# Altium schematic sheet MCU.SchDoc
size 420 x 297 mm; SheetNumber: 3; SheetTotal: 16
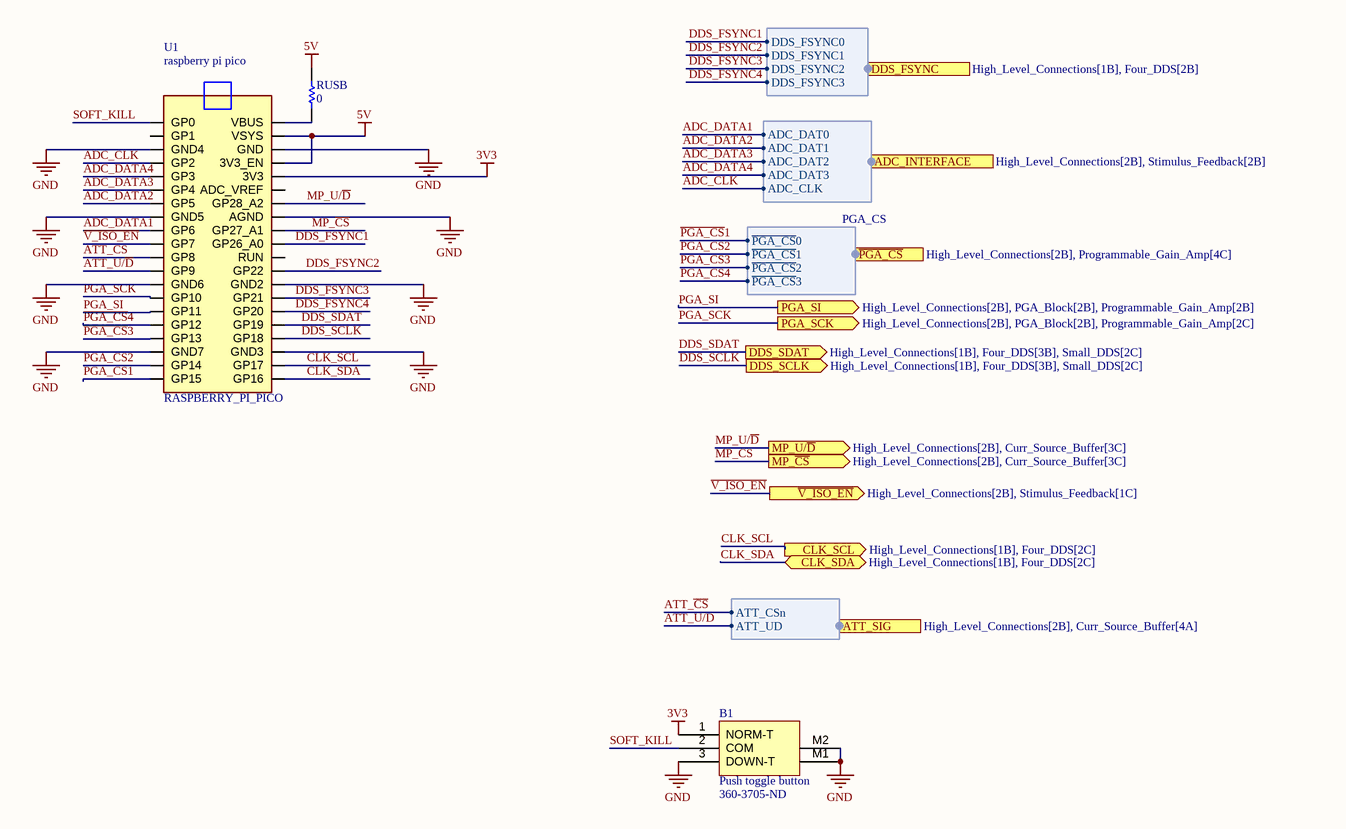
[diagram p0: MCU.SchDoc]

## Parts
B1  Push toggle button  Supplier Part Number 1: 360-3705-ND  [BB16AH-FA]
RUSB  value 0  [0402_Res]  (hidden comment: DNP)
U1  RASPBERRY_PI_PICO  [RASPBERRY_PI_PICO]

## Ports
ADC_INTERFACE (harness ADC_DATA, see High_Level_Connections[2B], Stimulus_Feedback[2B]), ATT_SIG (harness ATT, see High_Level_Connections[2B], Curr_Source_Buffer[4A]), CLK_SCL (out, see High_Level_Connections[1B], Four_DDS[2C]), CLK_SDA (bidir, see High_Level_Connections[1B], Four_DDS[2C]), DDS_FSYNC (harness DDS_FSYNC, see High_Level_Connections[1B], Four_DDS[2B]), DDS_SCLK (out, see High_Level_Connections[1B], Four_DDS[3B], Small_DDS[2C]), DDS_SDAT (out, see High_Level_Connections[1B], Four_DDS[3B], Small_DDS[2C]), MP_U/~{D} (out, see High_Level_Connections[2B], Curr_Source_Buffer[3C]), MP_~{CS} (out, see High_Level_Connections[2B], Curr_Source_Buffer[3C]), PGA_SCK (out, see High_Level_Connections[2B], PGA_Block[2B], Programmable_Gain_Amp[2C]), PGA_SI (out, see High_Level_Connections[2B], PGA_Block[2B], Programmable_Gain_Amp[2B]), ~{PGA_CS} (in, harness PGA_CS, see High_Level_Connections[2B], Programmable_Gain_Amp[4C]), ~{V_ISO_EN} (out, see High_Level_Connections[2B], Stimulus_Feedback[1C])

## Harnesses
ADC_DATA: ADC_DAT0, ADC_DAT1, ADC_DAT2, ADC_DAT3, ADC_CLK
PGA_CS: ~{PGA_CS}0, ~{PGA_CS}1, ~{PGA_CS}2, ~{PGA_CS}3
DDS_FSYNC: DDS_FSYNC0, DDS_FSYNC1, DDS_FSYNC2, DDS_FSYNC3
ATT: ATT_CSn, ATT_UD

## Nets
3V3: B1.1(NORM-T) U1.3V3
5V: RUSB.1 U1.3V3_EN U1.VSYS
GND: B1.3(DOWN-T) B1.M1 B1.M2 U1.AGND U1.GND U1.GND2 U1.GND3 U1.GND4 U1.GND5 U1.GND6 U1.GND7
~{PGA_CS}1: U1.GP15 ; port ~{PGA_CS}.~{PGA_CS}0
~{PGA_CS}2: U1.GP14 ; port ~{PGA_CS}.~{PGA_CS}1
~{PGA_CS}3: U1.GP13 ; port ~{PGA_CS}.~{PGA_CS}2
~{PGA_CS}4: U1.GP12 ; port ~{PGA_CS}.~{PGA_CS}3
~{V_ISO_EN}: U1.GP7 ; port ~{V_ISO_EN}
ADC_CLK: U1.GP2 ; port ADC_INTERFACE.ADC_CLK
ADC_DATA1: U1.GP6 ; port ADC_INTERFACE.ADC_DAT0
ADC_DATA2: U1.GP5 ; port ADC_INTERFACE.ADC_DAT1
ADC_DATA3: U1.GP4 ; port ADC_INTERFACE.ADC_DAT2
ADC_DATA4: U1.GP3 ; port ADC_INTERFACE.ADC_DAT3
ATT_~{CS}: U1.GP8 ; port ATT_SIG.ATT_CSn
ATT_U/~{D}: U1.GP9 ; port ATT_SIG.ATT_UD
CLK_SCL: U1.GP17 ; port CLK_SCL
CLK_SDA: U1.GP16 ; port CLK_SDA
DDS_FSYNC1: U1.GP26_A0 ; port DDS_FSYNC.DDS_FSYNC0
DDS_FSYNC2: U1.GP22 ; port DDS_FSYNC.DDS_FSYNC1
DDS_FSYNC3: U1.GP21 ; port DDS_FSYNC.DDS_FSYNC2
DDS_FSYNC4: U1.GP20 ; port DDS_FSYNC.DDS_FSYNC3
DDS_SCLK: U1.GP18 ; port DDS_SCLK
DDS_SDAT: U1.GP19 ; port DDS_SDAT
MP_~{CS}: U1.GP27_A1 ; port MP_~{CS}
MP_U/~{D}: U1.GP28_A2 ; port MP_U/~{D}
PGA_SCK: U1.GP10 ; port PGA_SCK
PGA_SI: U1.GP11 ; port PGA_SI
SOFT_KILL: B1.2(COM) U1.GP0
NetRUSB_2: RUSB.2 U1.VBUS

Not connected (* = marked no-connect by the designer): U1 ADC_VREF GP1 RUN

## Notes on the sheet
- THIS DOCUMENT AND THE DATA DISCLOSED HEREIN OR
- HEREWITH IS THE PROPERTY OF ALTIUM LIMITED AND MAY
- DWG NO:
- REVISION
- REV:
- DESCRIPTION
- DATE
- APPROVED
- BE FREELY DISTRIBUTED IN WHOLE. NO RIGHTS ARE
- RESERVED OR EXPRESS OR IMPLIED WARANTEE GIVEN.
- ENG:
- APPROVALS
- PROJECT
- DSN:
- CHK:
- REFERENCE DOCUMENTS
- PROJECT REVISION:
- TITLE
- DOCUMENT REVISION:
- DESIGN ITEM:
- BOM:
- FAB DWG:
- PCB DWG:
- ASSY DWG:
- SCALE:
- A3
- SIZE
- CAGE CODE
- FILE NAME
- DWG NO.
- SHEET
- OF
- REV
- (in symbol RASPBERRY_PI_PICO) raspberry pi pico

## Library data of the parts
B1 = BB16AH-FA: Supplier 1: DigiKey
RUSB = Res1: Resistor; Published: 8-Jun-2000; LatestRevisionDate: 17-Jul-2002; LatestRevisionNote: Re-released for DXP Platform.; PackageReference: AXIAL-0.3; Publisher: Altium Limited; PackageDescription: Axial Device, Thru-Hole; 2 Leads; 0.3 in Pin Spacing
U1 = RASPBERRY_PI_PICO: Raspberry Pi Board, Arm Cortex-M0+; Core Architecture:Arm; Core Sub-Architecture:Cortex-M0+; Kit Contents:Raspberry Pi Pico Board; No. Of Bits:32Bit; Silicon Core Number:Rp2040; Silicon Manufacturer:Raspberry Pi |Raspberry-Pi RASPBERRY PI PICO; SnapEDA_Link: https://www.snapeda.com/parts/RASPBERRY%20PI%20PICO/Raspberry+Pi/view-part/?ref=snap; Package: None; Value: *; MF: Raspberry Pi; MP: RASPBERRY PI PICO; Check_prices: https://www.snapeda.com/parts/RASPBERRY%20PI%20PICO/Raspberry+Pi/view-part/?ref=eda